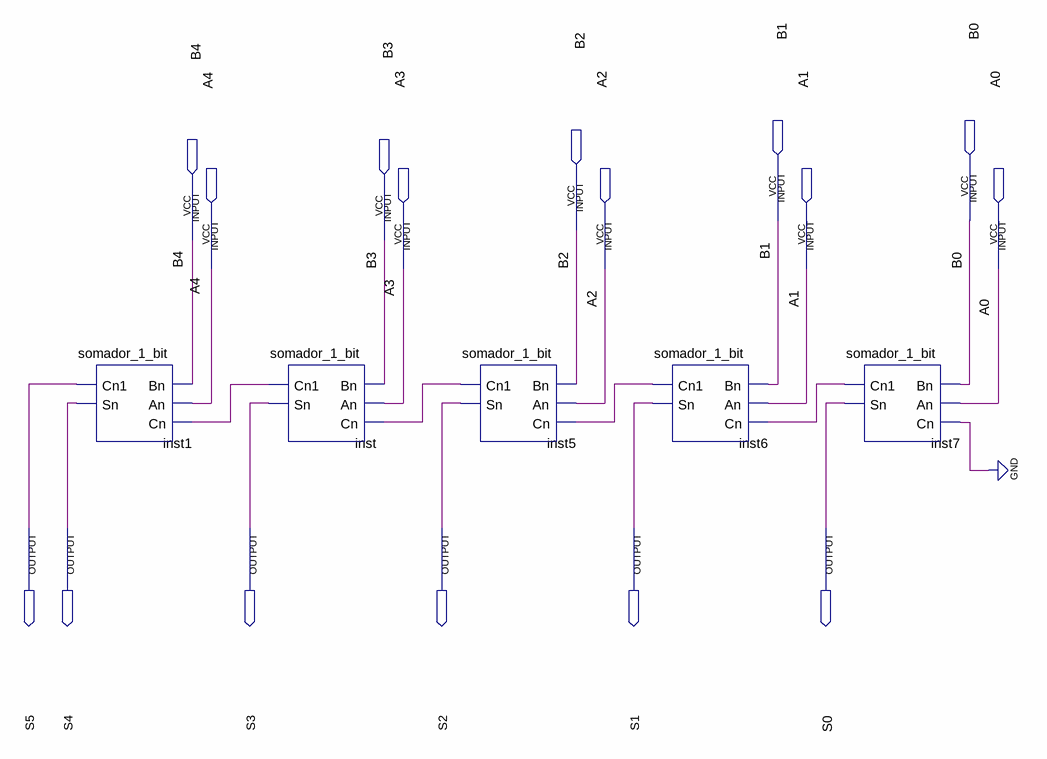
[diagram p0: schematic sheet]
// Quartus schematic somador_5_bits.bdf as structural Verilog: 5 symbols, 16 pins
module somador_5_bits (
  input  B1,
  input  B0,
  input  B2,
  input  B4,
  input  B3,
  input  A4,
  input  A3,
  input  A2,
  input  A1,
  input  A0,
  output S5,
  output S4,
  output S3,
  output S2,
  output S1,
  output S0
);

  wire inst5_cn1, inst6_cn1, inst7_cn1, inst_cn1;

  somador_1_bit inst1 (.Bn(B4), .An(A4), .Cn(inst_cn1), .Cn1(S5), .Sn(S4));
  somador_1_bit inst (.Bn(B3), .An(A3), .Cn(inst5_cn1), .Cn1(inst_cn1), .Sn(S3));
  somador_1_bit inst5 (.Bn(B2), .An(A2), .Cn(inst6_cn1), .Cn1(inst5_cn1), .Sn(S2));
  somador_1_bit inst6 (.Bn(B1), .An(A1), .Cn(inst7_cn1), .Cn1(inst6_cn1), .Sn(S1));
  somador_1_bit inst7 (.Bn(B0), .An(A0), .Cn(1'b0), .Cn1(inst7_cn1), .Sn(S0));
endmodule
